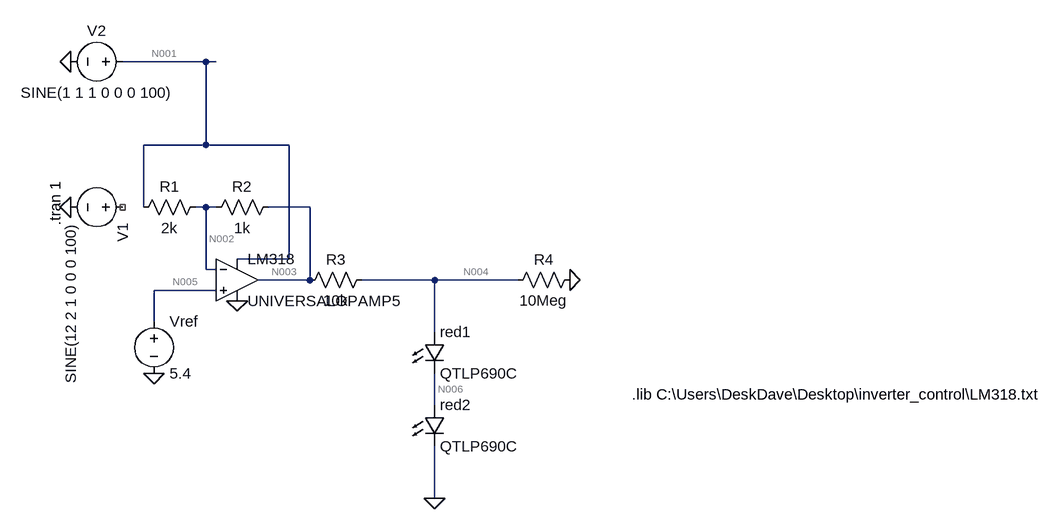
[diagram p0: schematic scaleVoltage.asc]
scaleVoltage.asc, the LTspice schematic file:
Version 4.1
SHEET 1 1692 680
WIRE 320 -96 192 -96
WIRE 336 -96 320 -96
WIRE 320 32 320 -96
WIRE 320 32 224 32
WIRE 448 32 320 32
WIRE 224 128 224 32
WIRE 320 128 304 128
WIRE 336 128 320 128
WIRE 480 128 416 128
WIRE 448 208 448 32
WIRE 448 208 368 208
WIRE 320 224 320 128
WIRE 336 224 320 224
WIRE 480 240 480 128
WIRE 480 240 400 240
WIRE 672 240 560 240
WIRE 800 240 672 240
WIRE 336 256 240 256
WIRE 240 304 240 256
WIRE 672 320 672 240
WIRE 672 432 672 384
WIRE 672 576 672 496
FLAG 112 128 0
FLAG 368 272 0
FLAG 240 384 0
FLAG 112 -96 0
FLAG 880 240 0
FLAG 672 576 0
SYMBOL voltage 208 128 R90
WINDOW 123 0 0 Left 0
WINDOW 39 0 0 Left 0
SYMATTR InstName V1
SYMATTR Value SINE(12 2 1 0 0 0 100)
SYMBOL res 320 112 R90
WINDOW 0 0 56 VBottom 2
WINDOW 3 32 56 VTop 2
SYMATTR InstName R1
SYMATTR Value 2k
SYMBOL res 432 112 R90
WINDOW 0 0 56 VBottom 2
WINDOW 3 32 56 VTop 2
SYMATTR InstName R2
SYMATTR Value 1k
SYMBOL voltage 240 288 R0
WINDOW 123 0 0 Left 0
WINDOW 39 0 0 Left 0
SYMATTR InstName Vref
SYMATTR Value 5.4
SYMBOL voltage 208 -96 R90
WINDOW 0 -32 56 VBottom 2
WINDOW 3 32 56 VTop 2
WINDOW 123 0 0 Left 0
WINDOW 39 0 0 Left 0
SYMATTR InstName V2
SYMATTR Value SINE(1 1 1 0 0 0 100)
SYMBOL OpAmps\\UniversalOpAmp5 368 240 R0
SYMATTR InstName LM318
SYMBOL res 576 224 R90
WINDOW 0 0 56 VBottom 2
WINDOW 3 32 56 VTop 2
SYMATTR InstName R3
SYMATTR Value 10k
SYMBOL res 896 224 R90
WINDOW 0 0 56 VBottom 2
WINDOW 3 32 56 VTop 2
SYMATTR InstName R4
SYMATTR Value 10Meg
SYMBOL LED 656 320 R0
SYMATTR InstName red1
SYMATTR Value QTLP690C
SYMBOL LED 656 432 R0
SYMATTR InstName red2
SYMATTR Value QTLP690C
TEXT 88 88 VRight 2 !.tran 1
TEXT 976 416 Left 2 !.lib C:\\Users\\DeskDave\\Desktop\\inverter_control\\LM318.txt

The netlist it stands for:
* scaleVoltage.asc
V1 NC_01 0 SINE(12 2 1 0 0 0 100)
R1 N002 N001 2k
R2 N003 N002 1k
Vref N005 0 5.4
V2 N001 0 SINE(1 1 1 0 0 0 100)
X§LM318 N005 N002 N001 0 N003 level5 Avol=1Meg GBW=10Meg Phimargin=45 SlewPos=10Meg SlewNeg=10Meg En=0 Enk=0 In=0 Ink=0 Rcm=500Meg Ccm=1p Rdiff=500k Cdiff=2p Ro=1k Vos=0 Ibp=2n Ibn=1n Iq=1m Rail=0 Ilimit=25m  ; UNIVERSALOPAMP5, pins In+ In- V+ V- OUT
R3 N004 N003 10k
R4 0 N004 10Meg
D§red1 N004 N006 QTLP690C
D§red2 N006 0 QTLP690C
.model D D
.lib standard.dio
.tran 1
.lib C:\Users\DeskDave\Desktop\inverter_control\LM318.txt
.backanno
.end

* Results of the author's LTspice run, read from the files saved beside the schematic
* Operating Point, zero values left out:
*   V(n002) = 1.006 V
*   V(n003) = 999.6 mV
*   V(n005) = 5.4 V
*   V(n006) = 499.3 mV
*   V(n001) = 1 V
*   V(n004) = 998.6 mV
*   I(R2) = -6.001 µA
*   I(R4) = -99.86 nA
*   I(V2) = -997.2 µA
*   I(R3) = -99.86 nA
*   I(R1) = 2.785 µA
*   I(Vref) = -8.801 µA
*   Ix(lm318:1) = 8.801 µA
*   Ix(lm318:2) = -8.787 µA
*   Ix(lm318:3) = 1 mA
*   Ix(lm318:4) = -1.006 mA
*   Ix(lm318:5) = 5.902 µA
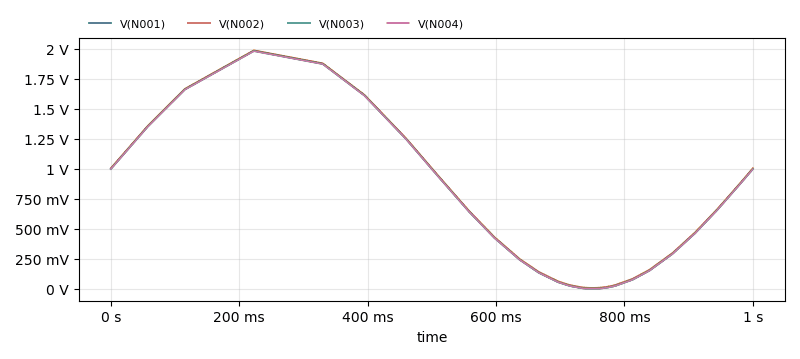
[diagram p1: Transient Analysis of scaleVoltage.asc, plotted from the saved traces]
* Transient Analysis, 1 run:
*   V(N001): min 0 V, max 1.984 V, average 991.7 mV, rms 1.215 V, last 1 V
*   V(N002): min 7.907 mV, max 1.988 V, average 997.3 mV, rms 1.219 V, last 1.006 V
*   V(N003): min 1.076 mV, max 1.984 V, average 991.3 mV, rms 1.215 V, last 999.6 mV
*   V(N004): min 1.075 mV, max 1.982 V, average 990.3 mV, rms 1.213 V, last 998.6 mV